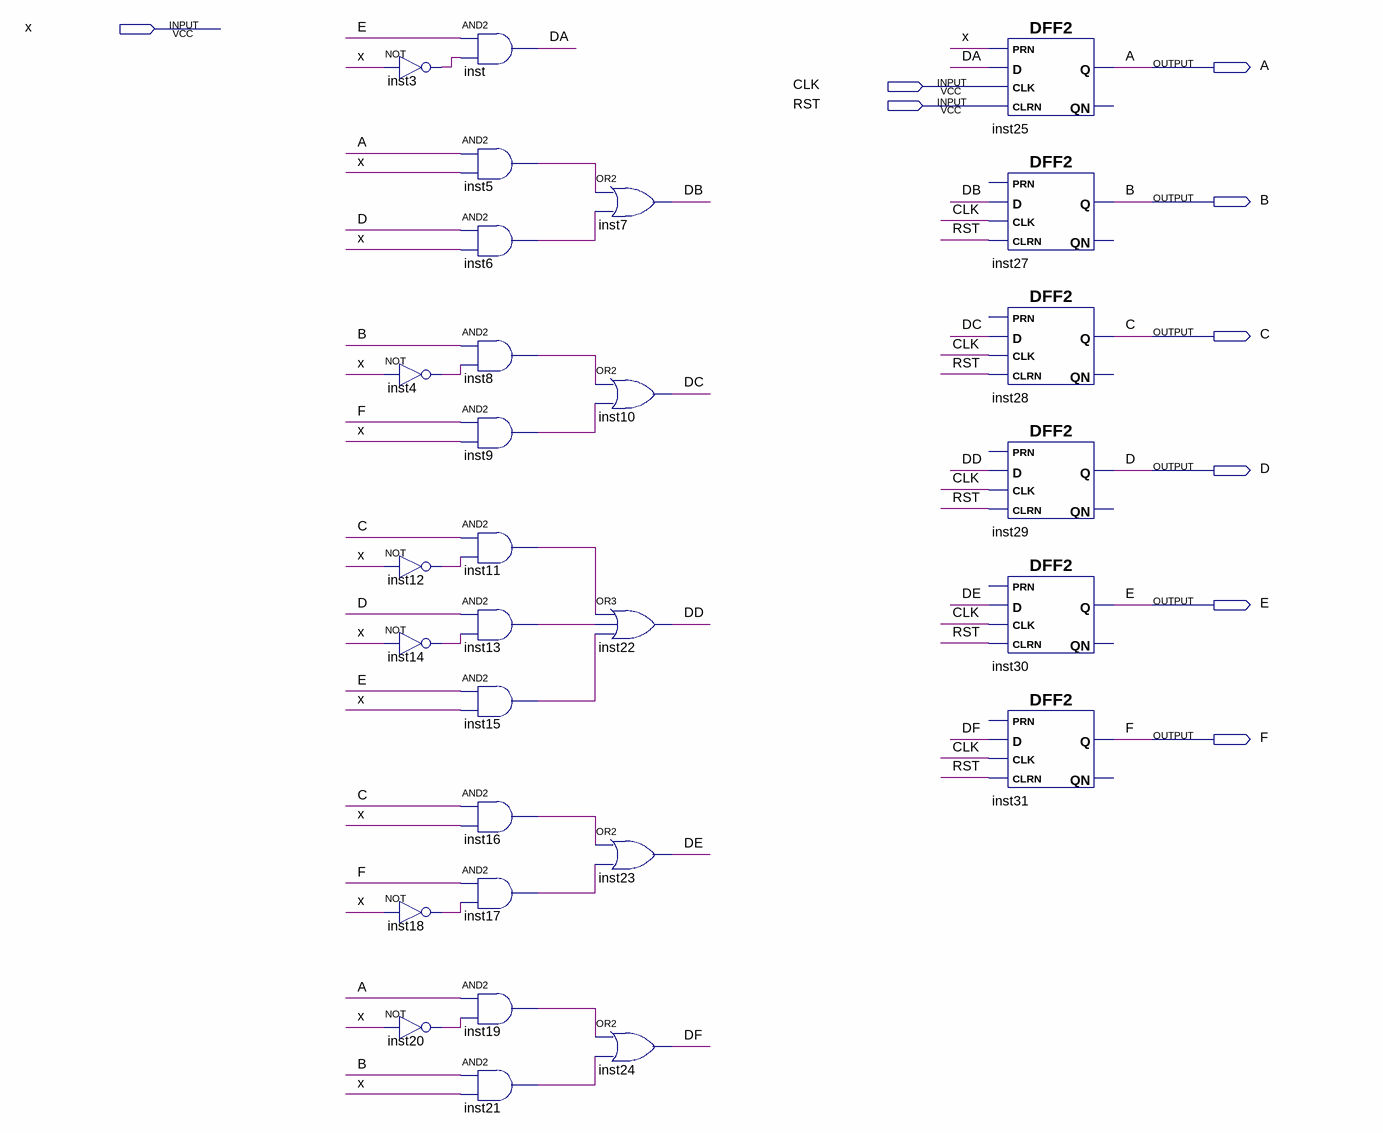
[diagram p0: schematic sheet]
// Quartus schematic homework05.bdf as structural Verilog: 29 symbols, 9 pins
module homework05 (
  input  x,
  input  CLK,
  input  RST,
  output A,
  output B,
  output C,
  output D,
  output E,
  output F
);

  wire DA, DB, DC, DD, DE, DF, inst3_out, inst4_out, inst5_out, inst6_out, inst8_out, inst9_out, inst11_out,
       inst12_out, inst13_out, inst14_out, inst15_out, inst16_out, inst17_out, inst18_out, inst19_out,
       inst20_out, inst21_out;

  not inst3 (inst3_out, x);
  not inst4 (inst4_out, x);
  not inst12 (inst12_out, x);
  not inst14 (inst14_out, x);
  not inst18 (inst18_out, x);
  not inst20 (inst20_out, x);
  and inst (DA, E, inst3_out);
  and inst5 (inst5_out, A, x);
  and inst6 (inst6_out, D, x);
  and inst8 (inst8_out, B, inst4_out);
  and inst9 (inst9_out, F, x);
  and inst11 (inst11_out, C, inst12_out);
  and inst13 (inst13_out, D, inst14_out);
  and inst15 (inst15_out, E, x);
  and inst16 (inst16_out, C, x);
  and inst17 (inst17_out, F, inst18_out);
  and inst19 (inst19_out, A, inst20_out);
  and inst21 (inst21_out, B, x);
  or inst7 (DB, inst5_out, inst6_out);
  or inst10 (DC, inst8_out, inst9_out);
  or inst22 (DD, inst11_out, inst13_out, inst15_out);
  or inst23 (DE, inst16_out, inst17_out);
  or inst24 (DF, inst19_out, inst21_out);
  DFF2 inst25 (.CLK(CLK), .D(DA), .PRN(x), .CLRN(RST), .Q(A));  // open: QN
  DFF2 inst27 (.CLK(CLK), .D(DB), .CLRN(RST), .Q(B));  // open: PRN, QN
  DFF2 inst28 (.CLK(CLK), .D(DC), .CLRN(RST), .Q(C));  // open: PRN, QN
  DFF2 inst29 (.CLK(CLK), .D(DD), .CLRN(RST), .Q(D));  // open: PRN, QN
  DFF2 inst30 (.CLK(CLK), .D(DE), .CLRN(RST), .Q(E));  // open: PRN, QN
  DFF2 inst31 (.CLK(CLK), .D(DF), .CLRN(RST), .Q(F));  // open: PRN, QN
endmodule
